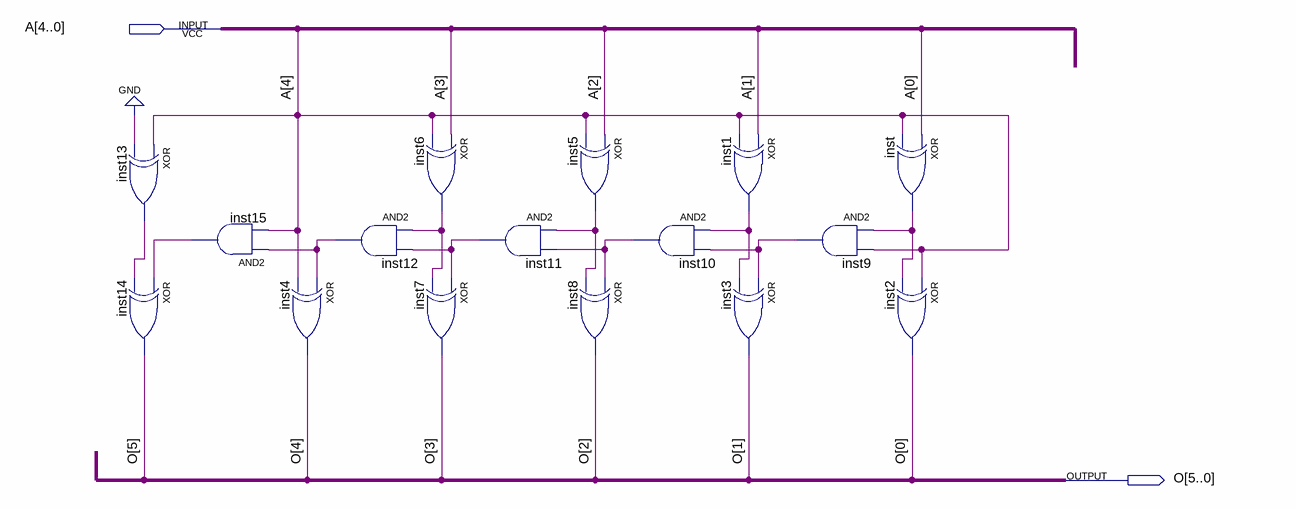
[diagram p0: schematic sheet]
// Quartus schematic C2.bdf as structural Verilog: 16 symbols, 2 pins
module C2 (
  input  [4:0] A,
  output [5:0] O
);

  wire inst1_out, inst5_out, inst6_out, inst9_out, inst10_out, inst11_out, inst12_out, inst13_out,
       inst15_out, inst_out;

  xor inst13 (inst13_out, A[4], 1'b0);
  xor inst14 (O[5], inst15_out, inst13_out);
  and inst15 (inst15_out, inst12_out, A[4]);
  and inst12 (inst12_out, inst6_out, inst11_out);
  xor inst4 (O[4], inst12_out, A[4]);
  xor inst6 (inst6_out, A[3], A[4]);
  xor inst7 (O[3], inst11_out, inst6_out);
  and inst11 (inst11_out, inst5_out, inst10_out);
  xor inst5 (inst5_out, A[2], A[4]);
  xor inst8 (O[2], inst10_out, inst5_out);
  and inst10 (inst10_out, inst1_out, inst9_out);
  xor inst1 (inst1_out, A[1], A[4]);
  xor inst3 (O[1], inst9_out, inst1_out);
  and inst9 (inst9_out, inst_out, A[4]);
  xor inst (inst_out, A[0], A[4]);
  xor inst2 (O[0], A[4], inst_out);
endmodule
